# Altium schematic sheet rs485.SchDoc
size A4
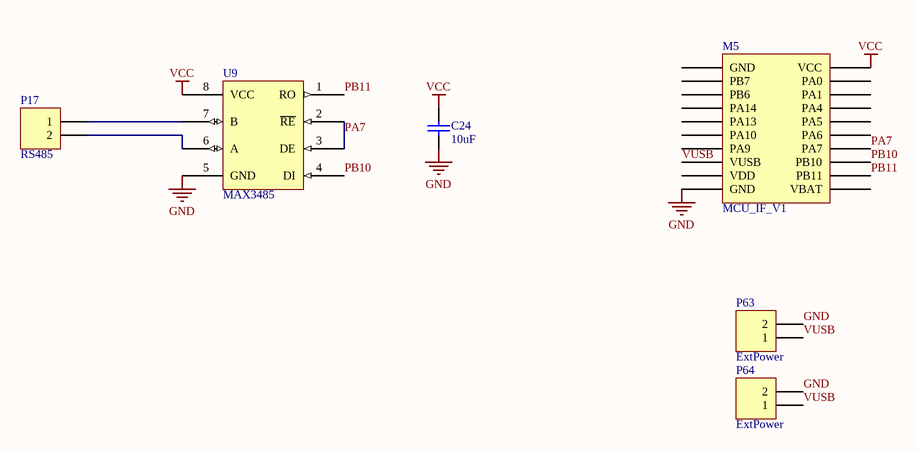
[diagram p0: rs485.SchDoc]

## Parts
C24  value 10uF  [C-2012[0805]]  (hidden comment: Cap Semi)
M5  MCU_IF_V1  [MCU_IF_V2]
P17  RS485  [Edge5.08mm2P]
P63  ExtPower  [HDR1X2H]
P64  ExtPower  [HDR1X2H]
U9  MAX3485  [SOP8]

## Nets
GND: C24.2 M5.10(GND) P63.2 P64.2 U9.5(GND)
VCC: C24.1 M5.20(VCC) U9.8(VCC)
PA7: M5.14(PA7) U9.2(~{RE}) U9.3(DE)
PB10: M5.13(PB10) U9.4(DI)
PB11: M5.12(PB11) U9.1(RO)
VUSB: M5.8(VUSB) P63.1 P64.1
NetP17_1: P17.1 U9.7(B)
NetP17_2: P17.2 U9.6(A)

Not connected (* = marked no-connect by the designer): M5 1(GND) 2(PB7) 3(PB6) 4(PA14) 5(PA13) 6(PA10) 7(PA9) 9(VDD) 11(VBAT) 15(PA6) 16(PA5) 17(PA4) 18(PA1) 19(PA0)

## Library data of the parts
C24 = Cap Semi: Capacitor (Semiconductor SIM Model); Published: 8-Jun-2000; LatestRevisionDate: 29-May-2009; LatestRevisionNote: IPC-7351 Footprint Added.; PackageReference: C1206; Publisher: Altium Limited; PackageDescription: Chip Capacitor
P17 = Header 2: Header, 2-Pin; LatestRevisionDate: 17-Jul-2002; LatestRevisionNote: Re-released for DXP Platform.; Publisher: Altium Limited
P63 P64 = Header 2H: Header, 2-Pin, Right Angle; LatestRevisionDate: 17-Jul-2002; LatestRevisionNote: Re-released for DXP Platform.; Publisher: Altium Limited